# EasyEDA Pro project 基于51单片机的全自动洗衣机.eprj

# Schematic Schematic1
Board Name: Board1; Create Date: 2025-02-23; Page Name: P1; Project Name: 基于51单片机的全自动洗衣机; Schematic Name: Schematic1; Update Date: 2025-02-23; Company: 嘉立创EDA; Page Size: A4; Version: V1.0
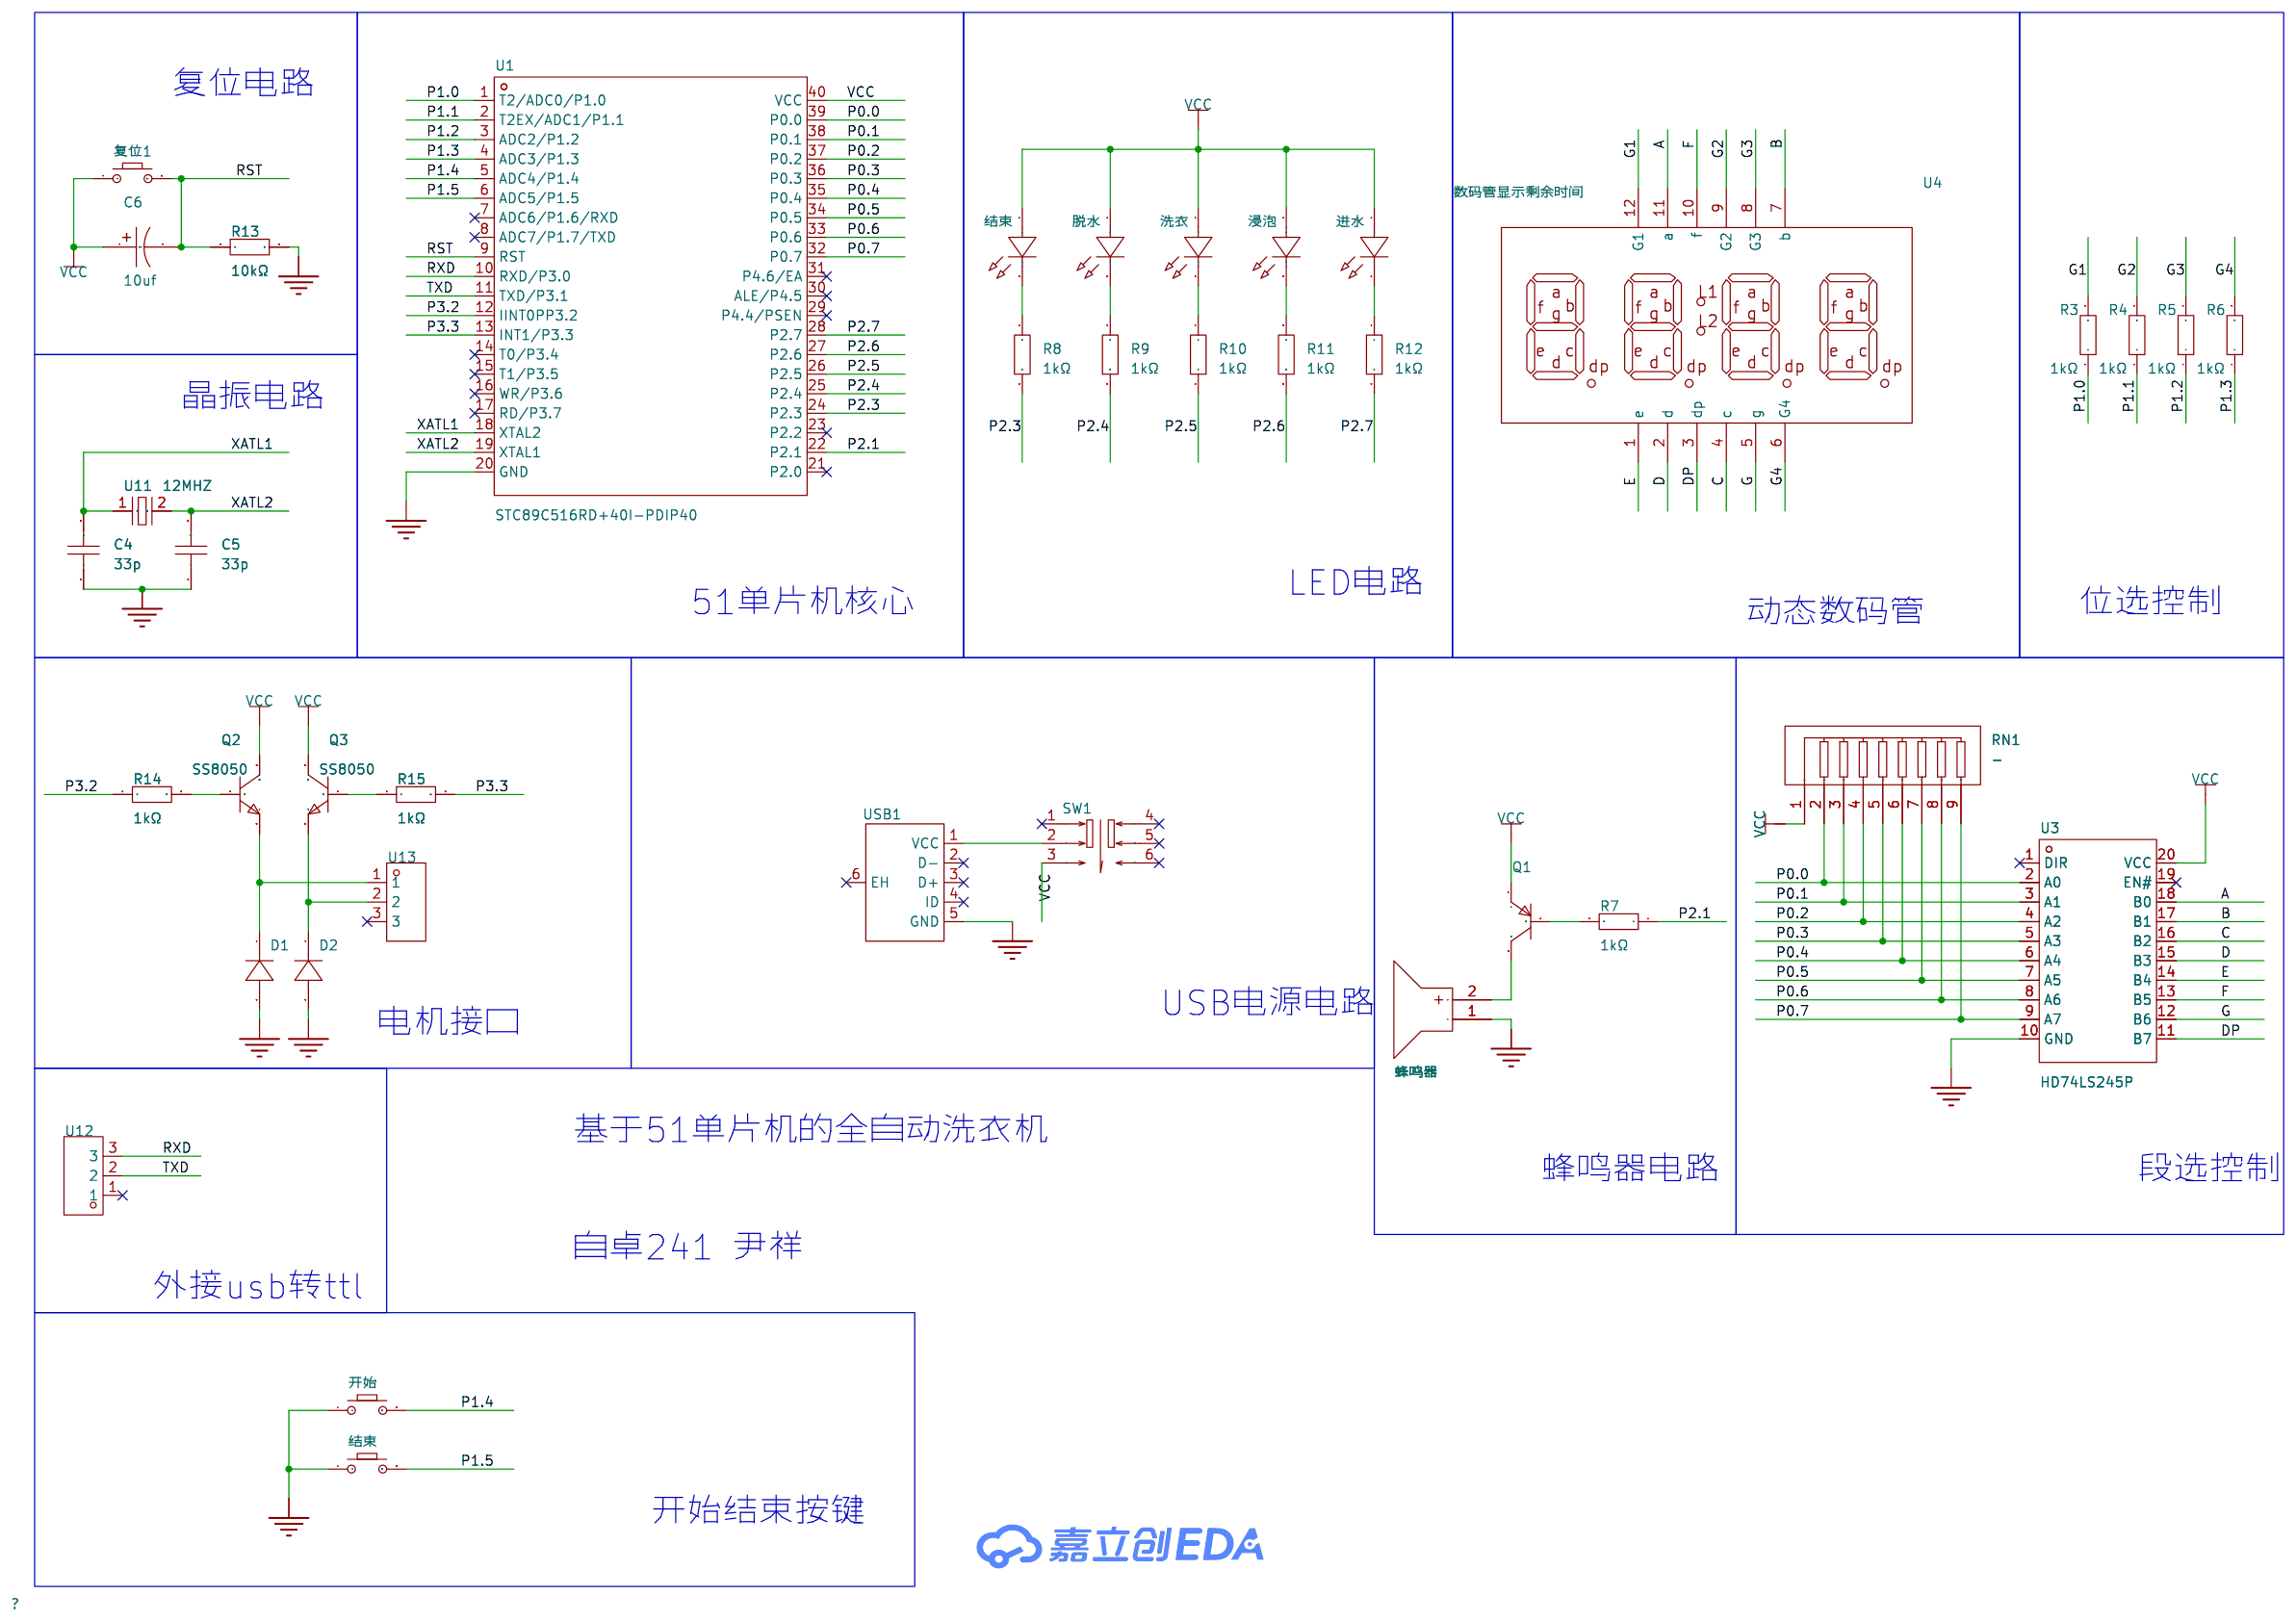
[diagram p0: schematic sheet]

## Parts
C4  33p  [CAP-TH_L10.0-W4.5-P7.50-D0.6]
C5  33p  [CAP-TH_L10.0-W4.5-P7.50-D0.6]
C6  10uf  [CAP-TH_BD10.0-P5.00-D0.6-FD]
D1  -  [DO_1N4007]
D2  -  [DO_1N4007]
Q1  -  [S8550P_TO-92]
Q2  SS8050  [SOT-23-3_L2.9-W1.3-P1.90-LS2.4-BR]
Q3  SS8050  [SOT-23-3_L2.9-W1.3-P1.90-LS2.4-BR]
R3  1kΩ  [Res_1/8W]
R4  1kΩ  [Res_1/8W]
R5  1kΩ  [Res_1/8W]
R6  1kΩ  [Res_1/8W]
R7  1kΩ  [Res_1/8W]
R8  1kΩ  [Res_1/8W]
R9  1kΩ  [Res_1/8W]
R10  1kΩ  [Res_1/8W]
R11  1kΩ  [Res_1/8W]
R12  1kΩ  [Res_1/8W]
R13  10kΩ  [Res_1/8W]
R14  1kΩ  [Res_1/8W]
R15  1kΩ  [Res_1/8W]
RN1  -  [RES-ARRAY-TH_9P-P2.54-D1.0]
SW1  SP-2212  [SW-TH_6P-L7.2-W7.2-P2.00-LS5.0]
U1  STC89C516RD+40I-PDIP40  [DIP-40_L52.3-W13.9-P2.54-LS15.2-BL]
U3  HD74LS245P  [DIP-20_L26.8-W6.4-P2.54-LS7.6-BL]
U4  数码管显示剩余时间  [LED-SEG-TH_12P-L32.1-W10.0-P12.7-S7.62-BL]
U11  12MHZ  [HC-49S_L11.0-W4.7-P4.88]
U12  2.54MM间距单排插针3P/高度11mm  [HDR-TH_3P-P2.54-V-M]
U13  2.54MM间距单排插针3P/高度11mm  [HDR-TH_3P-P2.54-V-M]
USB1  -  [USB_Micro]
图书馆1  脱水  [LED-TH_BD3.0-P2.54-FD]
复位1  -  [Key_TH_3.5x6x4.3]
学生宿舍1  洗衣  [LED-TH_BD3.0-P2.54-FD]
开始  -  [Key_TH_3.5x6x4.3]
打铃1  蜂鸣器  [BUZ-TH_BD12.0-P6.00-D0.9-RD]
教十楼1  浸泡  [LED-TH_BD3.0-P2.54-FD]
结束  -  [Key_TH_3.5x6x4.3]
综合南楼1  进水  [LED-TH_BD3.0-P2.54-FD]
路灯1  结束  [LED-TH_BD3.0-P2.54-FD]

## Library data of the parts
C4 C5 = 250V 0.1uF 5% CBB电容: 容值:-;额定电压:-;; LCSC Part Name: 0.1uF 5% 250V 电容; Supplier Part: C46804; Supplier Footprint: CBB电容 7.5mm; JLCPCB Part Class: 扩展库; Supplier: LCSC
C6 = LF221M1HBKJ1013VGN: Supplier Part: C9900022454; Supplier Footprint: 直插电解电容（高频）,220uF±20%,50V,Pitch=5mm,φ10mm,H13mm,剪脚，脚长3.6mm，佳维诚; JLCPCB Part Class: 扩展库; Supplier: LCSC
D1 D2 = D_1N4007A: Supplier Footprint: DO-41
Q1 = S8550_TO_PNP: Supplier Footprint: TO-92
Q2 Q3 = SS8050(RANGE:200-350)_C2150: LCSC Part Name: NPN 电流:1.5A 耐压:25V hfe=200~350; Supplier Part: C2150; Manufacturer: CJ(江苏长电/长晶); Supplier Footprint: SOT-23; JLCPCB Part Class: 基础库; Datasheet: https://atta.szlcsc.com/upload/public/pdf/source/20230322/AEE86F4B043774EFF80CAEA14A37D9E9.pdf; Supplier: LCSC; Transistor Type: NPN; Collector Current (Ic): 1.5A; Collector-Emitter Breakdown Voltage (Vceo): 25V; Power Dissipation (Pd): 300mW; DC Current Gain (hFE@Ic,Vce): 200@800mA,1V; Transition Frequency (fT): 100MHz; Collector Cut-Off Current (Icbo): 100nA; Collector-Emitter Saturation Voltage (VCE(sat)@Ic,Ib): 500mV@800mA,80mA; Operating Temperature: -55℃~+150℃
R3-R15 = Res_AXIAL-1/8W: Supplier Footprint: 轴向引线
RN1 = 排阻 10 K 5%: 电阻器数:-;阻值:-;单个元件功率:-;; LCSC Part Name: 10KΩ (103) ±5%; Supplier Part: C26615; Supplier Footprint: 插件; JLCPCB Part Class: 扩展库; Supplier: LCSC
SW1 = SP-2212: 电路结构:双刀双掷;自锁/无锁:自锁;安装方式:直插;触点电流:100mA;额定电压 (DC):30V;作用力:230gf;机械寿命:1.2万次;; LCSC Part Name: 轻触开关自锁; Supplier Part: C589287; Manufacturer: RISHENG(日昇); Supplier Footprint: 插件; JLCPCB Part Class: 扩展库; Datasheet: https://atta.szlcsc.com/upload/public/pdf/source/20200922/C589287_2DDFEABD4C802D7BFB6520C1CABFFDEF.pdf; Supplier: LCSC; Circuit: 双刀双掷; Self Lock / No Lock: 自锁; Actuator Style: 矩形柱塞; Mounting Style: 直插; Contact Current: 100mA; Voltage Rating (DC): 30V; Insulation Resistance: 100MΩ; Actuator/Cap Color: 蓝色; Pin Style: PC引脚; Operating Force: 230gf; Mechanical Life: 1.2万次
U1 = STC89C516RD+40I-PDIP40: CPU内核:51系列;程序存储容量:61KB;RAM总容量:1.25KB;GPIO端口数量:35;工作电压范围:3.5V~5.5V;CPU最大主频:-;程序存储器类型:FLASH;; Supplier Part: C52225; Manufacturer: STC(宏晶); Supplier Footprint: DIP-40; JLCPCB Part Class: 扩展库; Datasheet: https://atta.szlcsc.com/upload/public/pdf/source/20180614/C87831_BBAF7FB8B286C29ACE4E9B180C033FEC.pdf; Supplier: LCSC; CPU Core: 51系列; Program Storage Size: 61KB; RAM Size: 1.25KB; GPIO Ports Number: 35; Operating Voltage Range: 3.5V~5.5V; Program Memory Type: FLASH; Operating Temperature Range: -40℃~+85℃; 16Bit Timer: 3; UART/USART: 1; Peripheral/Function: 看门狗; Watchdog: 有
U3 = HD74LS245P: Supplier Part: C5349; Manufacturer: RENESAS(瑞萨)/IDT; Supplier Footprint: DIP-20; JLCPCB Part Class: 扩展库; Datasheet: https://atta.szlcsc.com/upload/public/pdf/source/20161119/1479540128687.pdf; Supplier: LCSC
U4 = 0.28 4位 数码管: Supplier Part: C9900013351; Supplier Footprint: DIP-12; JLCPCB Part Class: 扩展库; Supplier: LCSC
U11 = 直插晶振: Supplier Part: C9900021663; Supplier Footprint: HC-49S; JLCPCB Part Class: 扩展库; Supplier: LCSC
U12 U13 = 2.54MM间距单排插针3P/高度11mm: Supplier Part: C9900010938; JLCPCB Part Class: 扩展库; Supplier: LCSC
USB1 = USB_Micro-B: Supplier Footprint: SMD
图书馆1 学生宿舍1 教十楼1 综合南楼1 路灯1 = 3mmFIR: Supplier Part: C9900095018; Supplier Footprint: LED-TH_LED-3MM_RED; JLCPCB Part Class: 扩展库; Supplier: LCSC
复位1 开始 结束 = Key_TH_3.5x6x4.3: Supplier Footprint: 插件
打铃1 = buzzer: Supplier Part: C9900014030; Manufacturer Part: 打铃; JLCPCB Part Class: 扩展库; Supplier: LCSC

## Nets
GND: C4.1 C5.1 D1.2(A) D2.2(A) R13.2 U1.20(GND) U3.10(GND) USB1.5(GND) 开始.A 打铃1.1(-) 结束.A
VCC: C6.1 Q1.1(E) Q2.3(C) Q3.3(C) RN1.1 SW1.3 U1.40(VCC) U3.20(VCC) 图书馆1.1(A) 复位1.A 学生宿舍1.1(A) 教十楼1.1(A) 综合南楼1.1(A) 路灯1.1(A)
A: U3.18(B0) U4.11(a)
B: U3.17(B1) U4.7(b)
C: U3.16(B2) U4.4(c)
D: U3.15(B3) U4.2(d)
DP: U3.11(B7) U4.3(dp)
E: U3.14(B4) U4.1(e)
F: U3.13(B5) U4.10(f)
G: U3.12(B6) U4.5(g)
G1: R3.2 U4.12(G1)
G2: R4.2 U4.9(G2)
G3: R5.2 U4.8(G3)
G4: R6.2 U4.6(G4)
P0.0: RN1.2 U1.39(P0.0) U3.2(A0)
P0.1: RN1.3 U1.38(P0.1) U3.3(A1)
P0.2: RN1.4 U1.37(P0.2) U3.4(A2)
P0.3: RN1.5 U1.36(P0.3) U3.5(A3)
P0.4: RN1.6 U1.35(P0.4) U3.6(A4)
P0.5: RN1.7 U1.34(P0.5) U3.7(A5)
P0.6: RN1.8 U1.33(P0.6) U3.8(A6)
P0.7: RN1.9 U1.32(P0.7) U3.9(A7)
P1.0: R3.1 U1.1(T2/ADC0/P1.0)
P1.1: R4.1 U1.2(T2EX/ADC1/P1.1)
P1.2: R5.1 U1.3(ADC2/P1.2)
P1.3: R6.1 U1.4(ADC3/P1.3)
P1.4: U1.5(ADC4/P1.4) 开始.B
P1.5: U1.6(ADC5/P1.5) 结束.B
P2.1: R7.1 U1.22(P2.1)
P2.3: R8.2 U1.24(P2.3)
P2.4: R9.2 U1.25(P2.4)
P2.5: R10.2 U1.26(P2.5)
P2.6: R11.2 U1.27(P2.6)
P2.7: R12.2 U1.28(P2.7)
P3.2: R14.1 U1.12(IINT0PP3.2)
P3.3: R15.2 U1.13(INT1/P3.3)
RST: C6.2 R13.1 U1.9(RST) 复位1.B
RXD: U1.10(RXD/P3.0) U12.3
TXD: U1.11(TXD/P3.1) U12.2
XATL1: C4.2 U1.18(XTAL2) U11.1
XATL2: C5.2 U1.19(XTAL1) U11.2(GND)
$1N1439: Q1.2(B) R7.2
$1N1445: SW1.2 USB1.1(VCC)
$1N2133: Q2.1(B) R14.2
$1N2137: Q3.1(B) R15.1
Net-(D1-1): D1.1(K) Q2.2(E) U13.1
Net-(D2-1): D2.1(K) Q3.2(E) U13.2
Net-(Q1-3): Q1.3(C) 打铃1.2(+)
Net-(R8-1): R8.1 路灯1.2(K)
Net-(R9-1): R9.1 图书馆1.2(K)
Net-(R10-1): R10.1 学生宿舍1.2(K)
Net-(R11-1): R11.1 教十楼1.2(K)
Net-(R12-1): R12.1 综合南楼1.2(K)

Not connected (* = marked no-connect by the designer): SW1 1* 4* 5* 6*; U1 7(ADC6/P1.6/RXD)* 8(ADC7/P1.7/TXD)* 14(T0/P3.4)* 15(T1/P3.5)* 16(WR/P3.6)* 17(RD/P3.7)* 21(P2.0)* 23(P2.2)* 29(P4.4/PSEN)* 30(ALE/P4.5)* 31(P4.6/EA)*; U3 1(DIR)* 19(EN#)*; U12 1*; U13 3*; USB1 2(D-)* 3(D+)* 4(ID)* 6(EH)*

## Notes on the sheet
- 复位电路
- 晶振电路
- LED电路
- 51单片机核心
- 位选控制
- 动态数码管
- 电机接口
- USB电源电路
- 基于51单片机的全自动洗衣机
- 蜂鸣器电路
- 段选控制
- 自卓241 尹祥
- 外接usb转ttl
- 开始结束按键

# Board PCB4
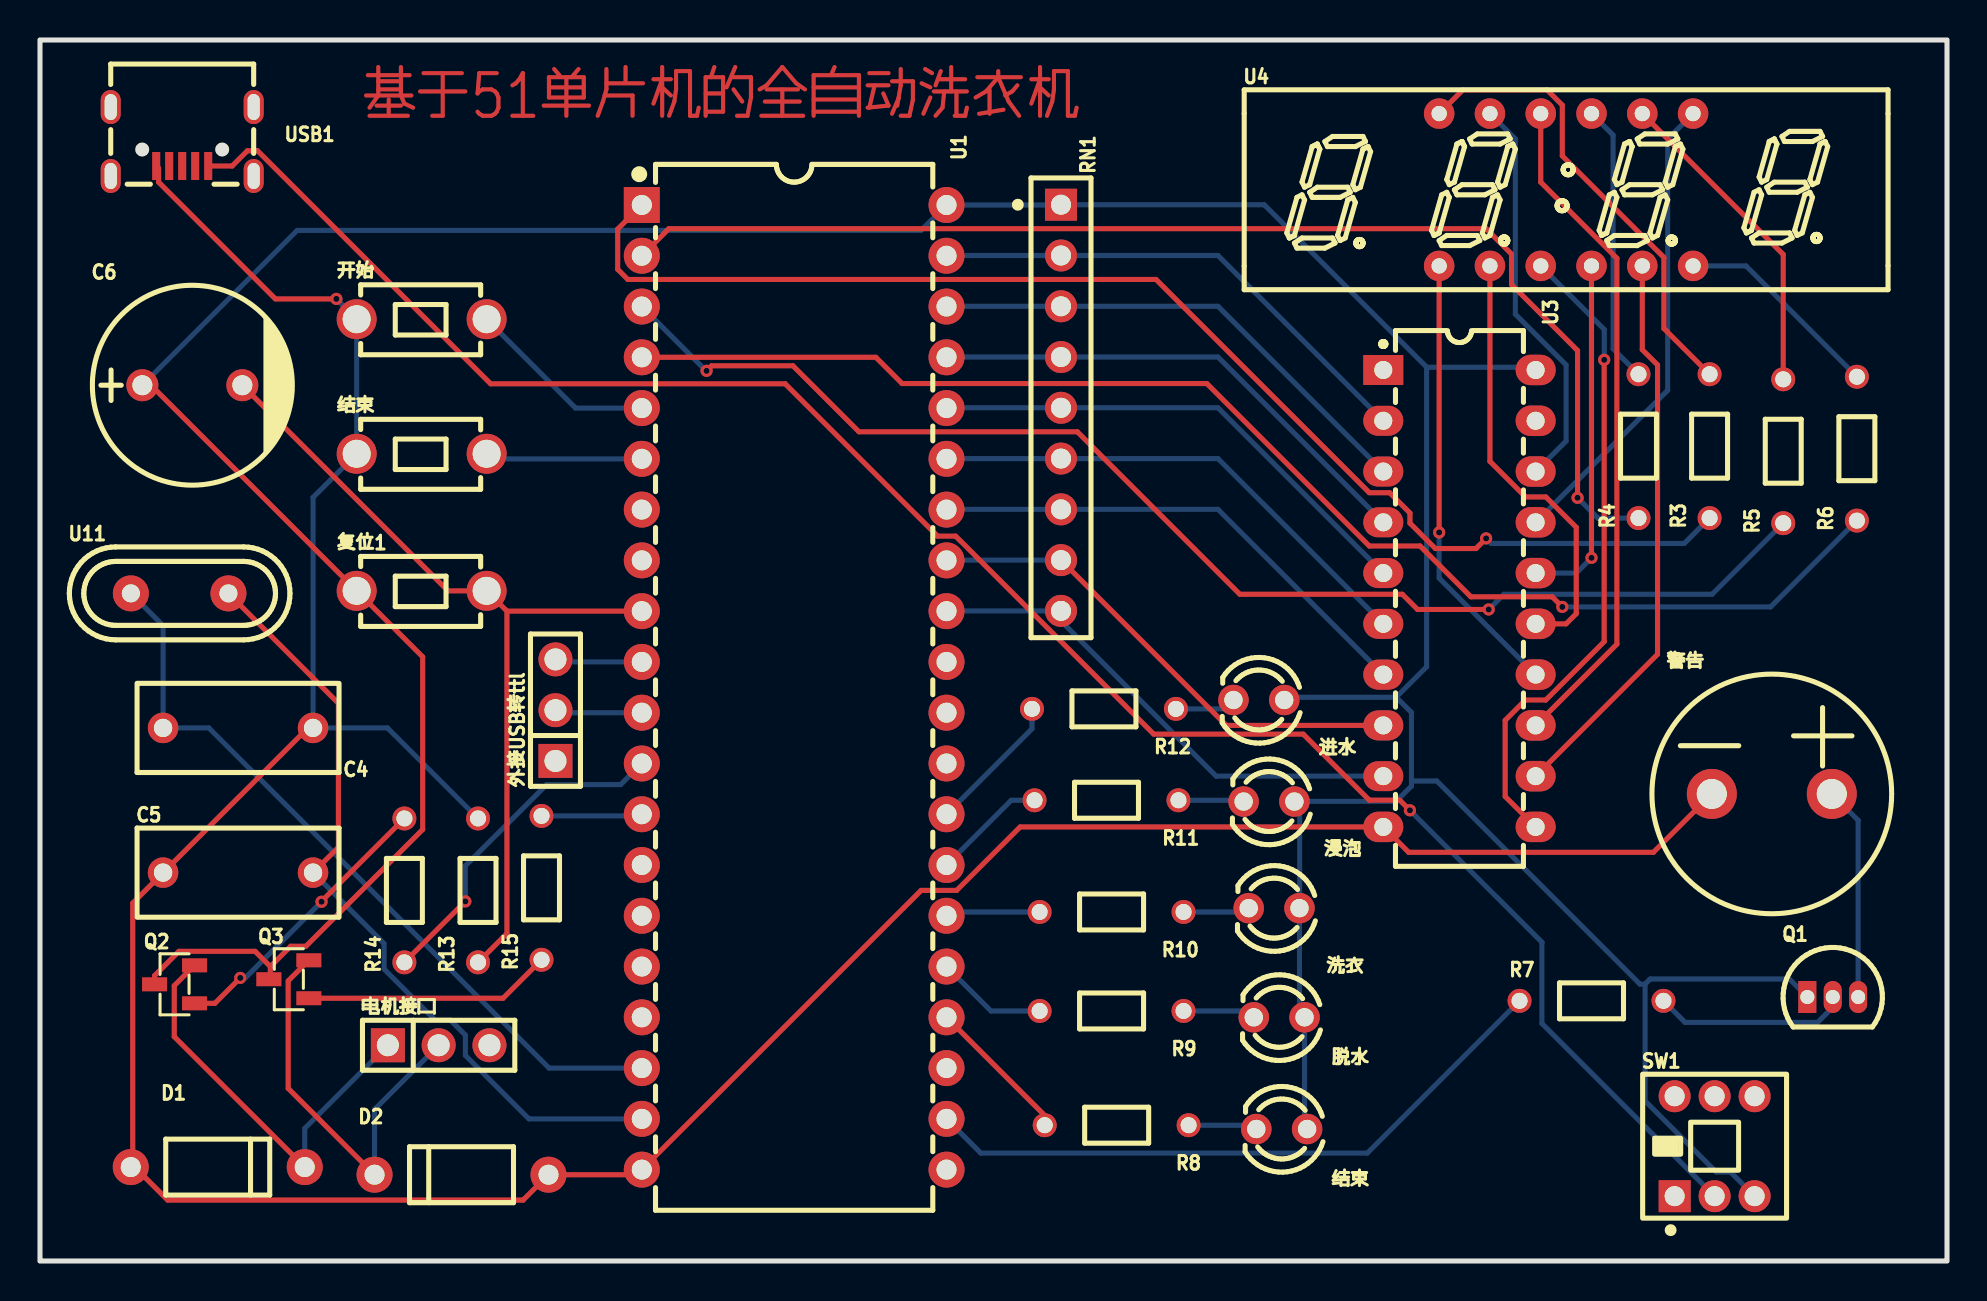
[diagram p1: board, top side]
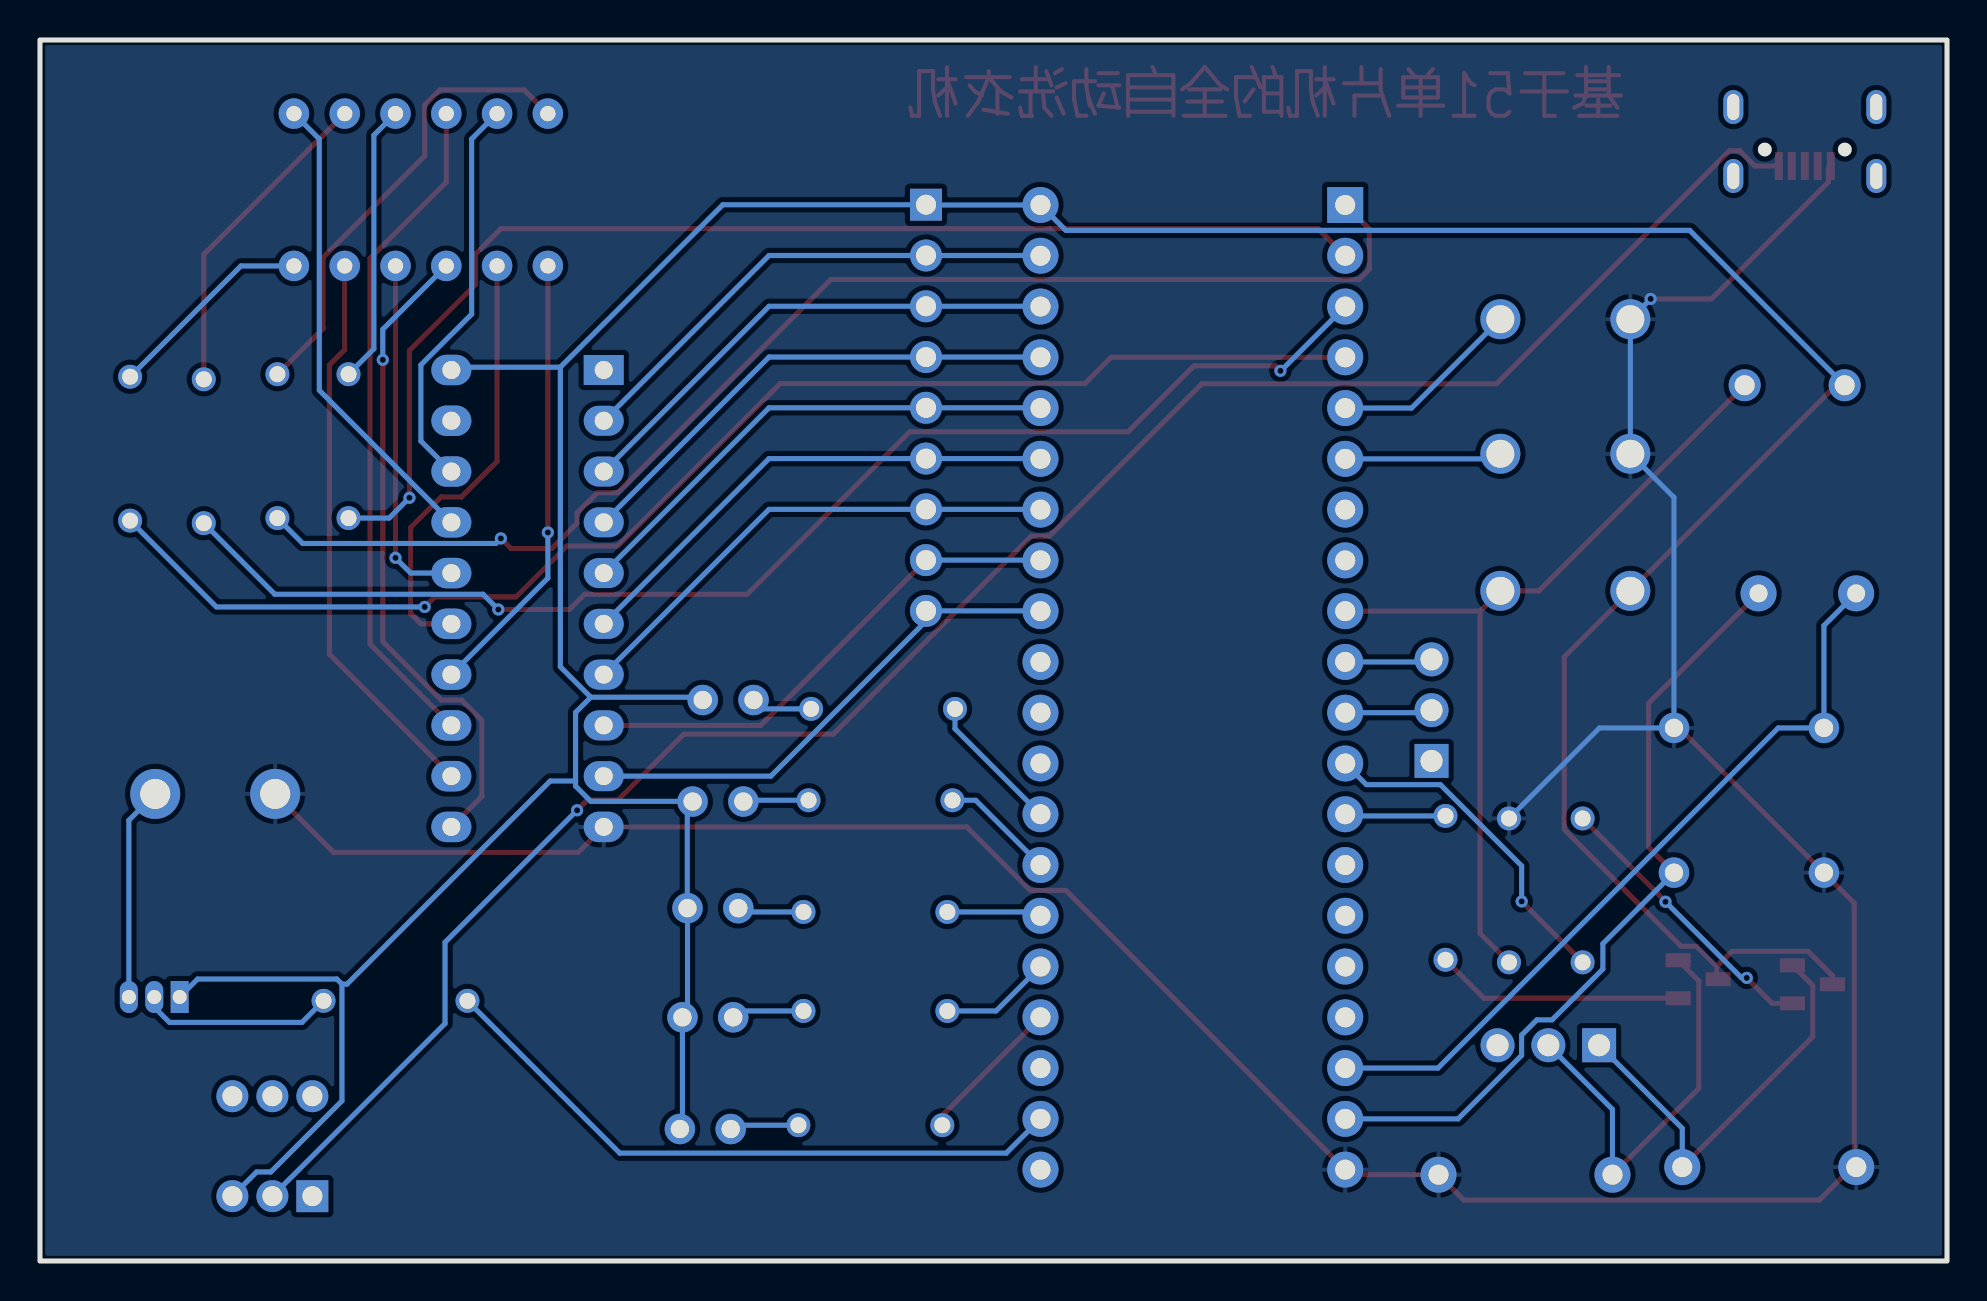
[diagram p2: board, bottom side, seen from below]

Outline 95.38 x 61.09 mm; copper layers: Top Layer, Bottom Layer. Coordinates in mm from the lower left corner of the outline.
Outline path: rectangle 0,61.09 95.38,0
Stack: Top Layer 0.035mm / Dielectric1 1.51mm FR4 er 4.5 / Bottom Layer 0.035mm

## Design rules (mm)
template: JLCPCB Capability(Two Layers Board)
spacing copperThickness1oz (default): track to track 0.102, other pairs 0.152 to 0.3
spacing copperThickness2oz: track to track 0.203, other pairs 0.152 to 0.3
track width copperThickness1oz (default): min 0.127, default 0.254, max 2.54
track width copperThickness2oz: min 0.203, default 0.254, max 2.54
differential pair differentialPair (default): width min 0.127, default 0.254, max 2.54; gap min 0.152, default 0.152
via viaSize (default): diameter min 0.5, default 0.61, max 10; hole min 0.3, default 0.305, max 6.3

## Placement (name value [footprint] x y rotation side)
C4  33p  [CAP-TH_L10.0-W4.5-P7.50-D0.6]  9.91 26.67 180 top
C5  33p  [CAP-TH_L10.0-W4.5-P7.50-D0.6]  9.91 19.43 0 top
C6  10uf  [CAP-TH_BD10.0-P5.00-D0.6-FD]  7.62 43.81 0 top
D1  -  [DO_1N4007]  8.89 4.7 180 top
D2  -  [DO_1N4007]  21.08 4.32 0 top
Q1  -  [S8550P_TO-92]  89.66 13.21 0 top
Q2  SS8050  [SOT-23-3_L2.9-W1.3-P1.90-LS2.4-BR]  6.73 13.84 0 top
Q3  SS8050  [SOT-23-3_L2.9-W1.3-P1.90-LS2.4-BR]  12.45 14.1 0 top
R3  1kΩ  [Res_1/8W]  83.57 40.77 90 top
R4  1kΩ  [Res_1/8W]  80.01 40.77 90 top
R5  1kΩ  [Res_1/8W]  87.25 40.51 90 top
R6  1kΩ  [Res_1/8W]  90.93 40.64 90 top
R7  1kΩ  [Res_1/8W]  77.6 12.95 0 top
R8  1kΩ  [Res_1/8W]  53.85 6.86 180 top
R9  1kΩ  [Res_1/8W]  53.59 12.57 180 top
R10  1kΩ  [Res_1/8W]  53.59 17.53 180 top
R11  1kΩ  [Res_1/8W]  53.34 23.11 180 top
R12  1kΩ  [Res_1/8W]  53.21 27.69 180 top
R13  10kΩ  [Res_1/8W]  21.97 18.54 90 top
R14  1kΩ  [Res_1/8W]  18.29 18.54 90 top
R15  1kΩ  [Res_1/8W]  25.15 18.67 90 top
RN1  -  [RES-ARRAY-TH_9P-P2.54-D1.0]  51.06 42.68 270 top
SW1  SP-2212  [SW-TH_6P-L7.2-W7.2-P2.00-LS5.0]  83.75 5.74 0 top
U1  STC89C516RD+40I-PDIP40  [DIP-40_L52.3-W13.9-P2.54-LS15.2-BL]  37.72 28.7 270 top
U3  HD74LS245P  [DIP-20_L26.8-W6.4-P2.54-LS7.6-BL]  70.99 33.15 270 top
U4  数码管显示剩余时间  [LED-SEG-TH_12P-L32.1-W10.0-P12.7-S7.62-BL]  76.33 53.59 0 top
U11  12MHZ  [HC-49S_L11.0-W4.7-P4.88]  6.99 33.4 0 top
USB1  -  [USB_Micro]  7.11 56.01 180 top
复位1  -  [Key_TH_3.5x6x4.3]  18.92 33.53 0 top
外接USB转ttl  2.54MM间距单排插针3P/高度11mm  [HDR-TH_3P-P2.54-V-M]  25.78 27.56 90 top
开始  -  [Key_TH_3.5x6x4.3]  18.92 47.12 0 top
洗衣  洗衣  [LED-TH_BD3.0-P2.54-FD]  61.72 17.65 180 top
浸泡  浸泡  [LED-TH_BD3.0-P2.54-FD]  61.47 22.99 180 top
电机接口  2.54MM间距单排插针3P/高度11mm  [HDR-TH_3P-P2.54-V-M]  19.94 10.79 0 top
结束  -  [Key_TH_3.5x6x4.3]  18.92 40.39 0 top
结束#2  -  [LED-TH_BD3.0-P2.54-FD]  62.1 6.6 180 top
脱水  脱水  [LED-TH_BD3.0-P2.54-FD]  61.98 12.19 180 top
警告  蜂鸣器  [BUZ-TH_BD12.0-P6.00-D0.9-RD]  86.61 23.37 0 top
进水  进水  [LED-TH_BD3.0-P2.54-FD]  60.96 28.07 180 top

## Footprints (pads in the part's own frame, mm; a bottom-side part is the same pattern mirrored in y, then rotated)
BUZ-TH_BD12.0-P6.00-D0.9-RD
  round 2.5 hole 1.5: 1(-3,0) 2(3,0)
CAP-TH_BD10.0-P5.00-D0.6-FD
  round 1.6 hole 1: 1(-2.5,0) 2(2.5,0)
CAP-TH_L10.0-W4.5-P7.50-D0.6
  round 1.524 hole 0.914: 1(-3.75,0) 2(3.75,0)
DIP-20_L26.8-W6.4-P2.54-LS7.6-BL
  rect 1.5x2 hole 0.9: 1(-11.43,-3.81)
  oval 1.5x2 hole 0.9: 2(-8.89,-3.81) 3(-6.35,-3.81) 4(-3.81,-3.81) 5(-1.27,-3.81) 6(1.27,-3.81) 7(3.81,-3.81) 8(6.35,-3.81) 9(8.89,-3.81)
  oval 1.524x2 hole 0.9: 10(11.43,-3.81) 11(11.43,3.81) 12(8.89,3.81) 13(6.35,3.81) 14(3.81,3.81) 15(1.27,3.81) 16(-1.27,3.81) 17(-3.81,3.81) 18(-6.35,3.81) 19(-8.89,3.81) 20(-11.43,3.81)
DIP-40_L52.3-W13.9-P2.54-LS15.2-BL
  rect 1.8x1.8 hole 1: 1(-24.13,-7.62)
  round 1.8 hole 1: 2(-21.59,-7.62) 3(-19.05,-7.62) 4(-16.51,-7.62) 5(-13.97,-7.62) 6(-11.43,-7.62) 7(-8.89,-7.62) 8(-6.35,-7.62) 9(-3.81,-7.62) 10(-1.27,-7.62) 11(1.27,-7.62) 12(3.81,-7.62) 13(6.35,-7.62) 14(8.89,-7.62) 15(11.43,-7.62) 16(13.97,-7.62) 17(16.51,-7.62) 18(19.05,-7.62) 19(21.59,-7.62) 20(24.13,-7.62) 21(24.13,7.62) 22(21.59,7.62) 23(19.05,7.62) 24(16.51,7.62) 25(13.97,7.62) 26(11.43,7.62) 27(8.89,7.62) 28(6.35,7.62) 29(3.81,7.62) 30(1.27,7.62) 31(-1.27,7.62) 32(-3.81,7.62) 33(-6.35,7.62) 34(-8.89,7.62) 35(-11.43,7.62) 36(-13.97,7.62) 37(-16.51,7.62) 38(-19.05,7.62) 39(-21.59,7.62) 40(-24.13,7.62)
DO_1N4007
  round 1.8 hole 1: 1(-4.35,0) 2(4.35,0)
HC-49S_L11.0-W4.7-P4.88
  round 1.8 hole 0.9: 1(-2.44,0) 2(2.44,0)
HDR-TH_3P-P2.54-V-M
  rect 1.7x1.7 hole 1.1: 1(-2.54,0)
  round 1.7 hole 1.1: 2(0,0) 3(2.54,0)
Key_TH_3.5x6x4.3
  round 1.999 hole 1.399: A(-3.084,0) B(3.416,0)
LED-SEG-TH_12P-L32.1-W10.0-P12.7-S7.62-BL
  round 1.524 hole 0.762: 1(-6.35,-3.81) 2(-3.81,-3.81) 3(-1.27,-3.81) 4(1.27,-3.81) 5(3.81,-3.81) 6(6.35,-3.81) 7(6.35,3.81) 8(3.81,3.81) 9(1.27,3.81) 10(-1.27,3.81) 11(-3.81,3.81) 12(-6.35,3.81)
LED-TH_BD3.0-P2.54-FD
  round 1.524 hole 0.914: 1(-1.27,0) 2(1.27,0)
RES-ARRAY-TH_9P-P2.54-D1.0
  rect 1.6x1.6 hole 1: 1(-10.16,0)
  round 1.6 hole 1: 2(-7.62,0) 3(-5.08,0) 4(-2.54,0) 5(0,0) 6(2.54,0) 7(5.08,0) 8(7.62,0) 9(10.16,0)
Res_1/8W
  round 1.199 hole 0.8: 1(-3.599,0.063) 2(3.599,0.063)
S8550P_TO-92
  rect 0.9x1.6 hole 0.7: 1(-1.27,0)
  oval 0.9x1.6 hole 0.7: 2(0,0) 3(1.27,0)
SOT-23-3_L2.9-W1.3-P1.90-LS2.4-BR
  rect 1.25x0.7 smd: 1(1,-0.95) 2(1,0.95) 3(-1,0)
SW-TH_6P-L7.2-W7.2-P2.00-LS5.0
  rect 1.6x1.6 hole 1: 1(-2,-2.5)
  round 1.6 hole 1: 2(0,-2.5) 3(2,-2.5) 4(-2,2.499) 5(0,2.5) 6(2,2.5)
USB_Micro
  rect 0.4x1.4 smd: 1(-1.3,1.225) 2(-0.65,1.225) 3(0,1.225) 4(0.65,1.225) 5(1.3,1.225)
  oval 1x1.7 hole 0.6x1.3: 6(-3.575,1.725) 6(-3.575,-1.725) 6(3.575,1.725) 6(3.575,-1.725)

## Nets
GND: C4.1 C5.1 D1.2 D2.2 R13.2 U1.20 U3.10 USB1.5 开始.A 结束.A 警告.1
VCC: C6.1 Q1.1 Q2.3 Q3.3 RN1.1 SW1.3 U1.40 U3.20 复位1.A 洗衣.1 浸泡.1 结束#2.1 脱水.1 进水.1
A: U3.18 U4.11
B: U3.17 U4.7
C: U3.16 U4.4
D: U3.15 U4.2
DP: U3.11 U4.3
E: U3.14 U4.1
F: U3.13 U4.10
G: U3.12 U4.5
G1: R3.2 U4.12
G2: R4.2 U4.9
G3: R5.2 U4.8
G4: R6.2 U4.6
P0.0: RN1.2 U1.39 U3.2
P0.1: RN1.3 U1.38 U3.3
P0.2: RN1.4 U1.37 U3.4
P0.3: RN1.5 U1.36 U3.5
P0.4: RN1.6 U1.35 U3.6
P0.5: RN1.7 U1.34 U3.7
P0.6: RN1.8 U1.33 U3.8
P0.7: RN1.9 U1.32 U3.9
P1.0: R3.1 U1.1
P1.1: R4.1 U1.2
P1.2: R5.1 U1.3
P1.3: R6.1 U1.4
P1.4: U1.5 开始.B
P1.5: U1.6 结束.B
P2.1: R7.1 U1.22
P2.3: R8.2 U1.24
P2.4: R9.2 U1.25
P2.5: R10.2 U1.26
P2.6: R11.2 U1.27
P2.7: R12.2 U1.28
P3.2: R14.1 U1.12
P3.3: R15.2 U1.13
RST: C6.2 R13.1 U1.9 复位1.B
RXD: U1.10 外接USB转ttl.3
TXD: U1.11 外接USB转ttl.2
XATL1: C4.2 U1.18 U11.1
XATL2: C5.2 U1.19 U11.2
$1N1437: Q1.3 警告.2
$1N1439: Q1.2 R7.2
$1N1445: SW1.2 USB1.1
$1N1572: R8.1 结束#2.2
$1N1573: R9.1 脱水.2
$1N1574: R10.1 洗衣.2
$1N1575: R11.1 浸泡.2
$1N1576: R12.1 进水.2
$1N2133: Q2.1 R14.2
$1N2137: Q3.1 R15.1
$1N2546: D1.1 Q2.2 电机接口.1
$1N2550: D2.1 Q3.2 电机接口.2

Pads without a net: SW1 1 4 5 6; U1 7 8 14 15 16 17 21 23 29 30 31; U3 1 19; USB1 2 3 4 6; 外接USB转ttl 1; 电机接口 3

## Via types
v1: diameter 0.61, hole 0.305, Top Layer to Bottom Layer, 13 vias

## Routing (per net, layer and track width the routed paths; a pad name or vN(x,y) marks a point on that pad's centre or on a via; arc(x,y) is an arc through that point)
GND: length 160.2
  Top Layer w0.254: 4.64,4.8 4.64,17.91 6.16,19.43 ; 4.64,4.8 D1.2 ; 4.64,4.8 6.39,3.05 24.16,3.05 D2.2 29.85,4.32 U1.20 44.07,18.54 45.85,18.54 49.02,21.72 67.18,21.72 68.45,20.45 80.69,20.45 警告.1 ; v1(14.82,48.13) 11.77,48.13 5.93,53.97 5.93,54.66 USB1.5 ; 6.16,19.43 13.4,26.67 C4.1 ; 6.16,19.43 C5.1
  Bottom Layer w0.254: v1(14.82,48.13) 开始.A 结束.A 13.66,38.2 C4.1 17.38,26.67 R13.2
VCC: length 211.4
  Top Layer w0.254: 11.52,14.73 12.54,15.75 13.3,15.75 19.14,21.59 19.14,30.23 复位1.A 5.55,43.81 C6.1 ; 11.52,14.73 11.52,14.17 Q3.3 ; 11.52,14.73 10.76,15.49 6.95,15.49 5.73,14.28 Q2.3
  Bottom Layer w0.254: 67.83,28.21 62.37,28.21 进水.1 ; 67.83,28.21 69.35,29.73 69.35,44.72 ; 67.83,28.21 68.59,27.44 68.59,24.01 ; 68.59,24.01 69.86,24.01 80.02,13.85 80.27,13.85 ; 68.59,24.01 68.59,23.76 67.83,23 63,23 ; U3.20 74.66,44.72 69.35,44.72 ; 69.35,44.72 61.22,52.84 51.06,52.84 51.05,52.83 U1.40 44.07,51.56 12.87,51.56 C6.1 ; 80.27,13.85 80.53,14.11 87.49,14.11 Q1.1 ; 80.27,13.85 80.27,8.01 83.83,4.46 84.54,4.46 SW1.3 ; 结束#2.1 63.25,6.73 63.25,12.19 62.99,12.45 洗衣.1 63,17.66 63,23 ; 63,23 浸泡.1
A: length 20.1
  Bottom Layer w0.254: U4.11 73.79,56.13 73.79,47.37 76.33,44.83 76.33,41.02 74.8,39.5
B: length 23.7
  Bottom Layer w0.254: U4.7 81.41,56.13 81.41,43.56 U3.17
C: length 17.7
  Top Layer w0.254: v1(77.6,35.18) U4.4
  Bottom Layer w0.254: U3.16 76.83,34.42 v1(77.6,35.18)
D: length 22
  Top Layer w0.254: U4.2 72.52,40 74.3,38.23 75.31,38.23 76.83,36.7 76.83,32.38 76.33,31.88 U3.15
DP: length 32.7
  Top Layer w0.254: 74.8,21.72 73.28,23.24 73.28,27.05 74.3,28.07 75.31,28.07 78.23,30.99 v1(78.23,45.08)
  Bottom Layer w0.254: U4.3 78.23,46.61 v1(78.23,45.08)
E: length 22.4
  Top Layer w0.254: v1(69.98,36.45) U4.1
  Bottom Layer w0.254: U3.14 69.98,34.16 v1(69.98,36.45)
F: length 33.9
  Top Layer w0.254: U3.13 78.87,30.86 78.87,50.16 75.06,53.97 U4.10
G: length 28.4
  Top Layer w0.254: U4.5 80.14,45.59 80.9,44.83 80.9,30.35 U3.12
G1: length 23.5
  Top Layer w0.254: U4.12 71.16,58.59 75.38,58.59 76.14,57.83 76.14,55.29 81.22,50.21 81.22,46.65 R3.2
G2: length 14
  Bottom Layer w0.254: R4.2 78.68,45.64 78.68,56.32 U4.9
G3: length 16.2
  Top Layer w0.254: U4.8 87.19,50.35 R5.2
G4: length 10.5
  Bottom Layer w0.254: U4.6 85.32,49.78 R6.2
P0.0: length 25.3
  Bottom Layer w0.254: U1.39 45.35,50.3 RN1.2 58.92,50.3 U3.2
P0.1: length 25.3
  Bottom Layer w0.254: U1.38 45.35,47.76 RN1.3 58.92,47.76 67.18,39.5
P0.2: length 25.3
  Bottom Layer w0.254: U1.37 45.35,45.22 RN1.4 58.92,45.22 U3.4
P0.3: length 25.3
  Bottom Layer w0.254: U3.5 58.92,42.68 RN1.5 45.35,42.68 U1.36
P0.4: length 25.3
  Bottom Layer w0.254: U3.6 58.92,40.14 45.35,40.14 U1.35
P0.5: length 25.3
  Bottom Layer w0.254: U3.7 58.92,37.6 RN1.7 45.35,37.6 U1.34
P0.6: length 25.3
  Top Layer w0.254: 51.06,35.06 59.33,26.8 U3.8
  Bottom Layer w0.254: U1.33 45.35,35.06 51.06,35.06
P0.7: length 25.6
  Bottom Layer w0.254: U1.32 45.35,32.52 RN1.9 51.06,32.02 58.82,24.26 U3.9
P1.0: length 65.3
  Top Layer w0.254: v1(72.33,36.15) 71.82,35.64 69.79,35.64 68.52,36.91 68.52,37.42 67.5,38.44 66.48,38.44 55.82,49.11 29.4,49.11 28.89,49.61 28.89,51.63 U1.1
  Bottom Layer w0.254: v1(72.33,36.15) 72.58,35.9 82.23,35.9 R3.1
P1.1: length 61.6
  Top Layer w0.254: U1.2 31.45,51.65 72.33,51.65 73.6,50.38 73.6,48.85 76.9,45.55 v1(76.9,38.18)
  Bottom Layer w0.254: v1(76.9,38.18) 77.92,37.17 R4.1
P1.2: length 65.4
  Top Layer w0.254: v1(33.34,44.53) 33.59,44.79 37.66,44.79 40.96,41.49 51.88,41.49 60.01,33.36 68.14,33.36 68.9,32.6 v1(72.45,32.6)
  Bottom Layer w0.254: R5.1 83.63,33.36 73.22,33.36 v1(72.45,32.6) ; v1(33.34,44.53) 33.32,44.53 U1.3
P1.3: length 67.7
  Top Layer w0.254: U1.4 41.8,45.21 43.12,43.9 58.36,43.9 66.48,35.77 69.03,35.77 71.57,33.23 75.63,33.23 v1(76.14,32.72)
  Bottom Layer w0.254: 90.87,37.04 86.55,32.72 v1(76.14,32.72)
P1.4: length 9.6
  Bottom Layer w0.254: U1.5 26.78,42.67 开始.B
P1.5: length 7.9
  Bottom Layer w0.254: 结束.B 22.59,40.13 U1.6
P2.1: length 32.5
  Bottom Layer w0.254: R7.1 66.38,5.4 47.05,5.4 U1.22
P2.3: length 7.4
  Top Layer w0.254: R8.2 50.25,7.28 U1.24
P2.4: length 5.6
  Bottom Layer w0.254: R9.2 47.56,12.51 U1.25
P2.5: length 4.7
  Bottom Layer w0.254: R10.2 45.53,17.46 U1.26
P2.6: length 5.7
  Bottom Layer w0.254: R11.2 48.58,23.05 U1.27
P2.7: length 7
  Bottom Layer w0.254: U1.28 49.61,26.63 R12.2
P3.2: length 17
  Top Layer w0.254: R14.1 v1(21.27,17.99)
  Bottom Layer w0.254: U1.12 29.04,23.83 25.34,23.83 21.27,19.77 v1(21.27,17.99)
P3.3: length 5.1
  Bottom Layer w0.254: R15.2 30.02,22.27 U1.13
RST: length 42.8
  Top Layer w0.254: 23.35,32.51 23.35,16.39 R13.1 ; 23.35,32.51 U1.9 ; 23.35,32.51 复位1.B 20.41,33.53 C6.2
RXD: length 4.4
  Bottom Layer w0.254: 25.78,30.1 25.91,29.97 U1.10
TXD: length 4.4
  Bottom Layer w0.254: 外接USB转ttl.2 25.91,27.43 U1.11
XATL1: length 38.4
  Bottom Layer w0.254: U1.18 25.46,9.65 8.44,26.67 C4.2 6.16,31.79 U11.1
XATL2: length 39.7
  Top Layer w0.254: U11.2 14.93,27.9 14.93,20.7 C5.2
  Bottom Layer w0.254: U1.19 24.45,7.11 21.28,10.29 21.28,11.3 20.51,12.06 19.75,12.06 17.21,14.6 17.21,15.88 C5.2
$1N1437: length 10.7
  Bottom Layer w0.254: 警告.2 90.93,22.05 Q1.3
$1N1439: length 9.7
  Bottom Layer w0.254: 81.2,13.02 82.28,11.94 88.9,11.94 89.66,12.7 Q1.2
$1N1445: length 99.7
  Top Layer w0.254: USB1.1 9.61,54.78 10.37,55.54 10.88,55.54 22.54,43.88 37.27,43.88 44.89,36.26 45.8,36.26 55.7,26.36 63.18,26.36 66.48,23.06 68.01,23.06 v1(68.51,22.55)
  Bottom Layer w0.254: SW1.2 75.12,11.88 75.12,15.94 v1(68.51,22.55)
$1N1572: length 3.5
  Bottom Layer w0.254: 结束#2.2 60.64,6.79 R8.1
$1N1573: length 3.6
  Bottom Layer w0.254: R9.1 60.39,12.51 脱水.2
$1N1574: length 3.3
  Bottom Layer w0.254: R10.1 60.26,17.46 60.45,17.65
$1N1575: length 3.3
  Bottom Layer w0.254: R11.1 60.13,23.05 浸泡.2
$1N1576: length 3.1
  Bottom Layer w0.254: R12.1 59.25,27.62 进水.2
$1N2133: length 14.3
  Top Layer w0.254: Q2.1 8.75,12.89 v1(10.02,14.16) ; v1(14.08,17.97) 14.08,18 R14.2
  Bottom Layer w0.254: v1(14.08,17.97) 10.27,14.16 v1(10.02,14.16)
$1N2137: length 12.4
  Top Layer w0.254: R15.1 23.16,13.15 Q3.1
$1N2546: length 21
  Top Layer w0.254: Q2.2 6.72,13.78 6.72,11.22 13.24,4.7
  Bottom Layer w0.254: 电机接口.1 13.24,6.64 13.24,4.7
$1N2550: length 20.8
  Top Layer w0.254: Q3.2 12.41,14.01 12.41,8.64 D2.1
  Bottom Layer w0.254: D2.1 16.73,7.59 电机接口.2

## Copper pours and planes (outline as drawn; the poured copper is in the pictures)
GND on Bottom Layer: 0,61.21 95.38,61.21 95.38,0 0,0

## Text on the board
Top Layer: 基于51单片机的全自动洗衣机
